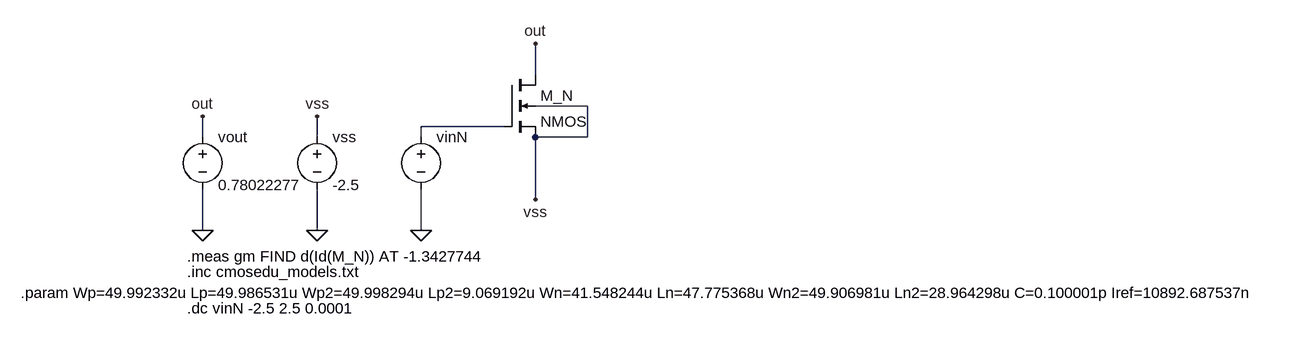
[diagram p0: schematic GM6.asc]
GM6.asc, the LTspice schematic file:
Version 4
SHEET 1 2412 680
WIRE 1008 -112 1008 -160
WIRE 1088 -64 1008 -64
WIRE 960 -32 832 -32
WIRE 496 -16 496 -48
WIRE 672 -16 672 -48
WIRE 832 -16 832 -32
WIRE 1088 -16 1088 -64
WIRE 1088 -16 1008 -16
WIRE 1008 80 1008 -16
WIRE 496 128 496 64
WIRE 672 128 672 64
WIRE 832 128 832 64
FLAG 832 128 0
FLAG 496 -48 out
FLAG 496 128 0
FLAG 1008 -160 out
FLAG 1008 80 vss
FLAG 672 -48 vss
FLAG 672 128 0
SYMBOL nmos4 960 -112 R0
SYMATTR InstName M_N
SYMATTR Value2 l={Ln2} w={Wn2}
SYMBOL voltage 832 -32 R0
WINDOW 3 24 44 Left 2
WINDOW 123 0 0 Left 2
WINDOW 39 0 0 Left 2
SYMATTR Value ""
SYMATTR InstName vinN
SYMBOL voltage 496 -32 R0
WINDOW 123 0 0 Left 2
WINDOW 39 0 0 Left 2
WINDOW 3 24 90 Left 2
SYMATTR Value 0.78022277
SYMATTR InstName vout
SYMBOL voltage 672 -32 R0
WINDOW 123 0 0 Left 2
WINDOW 39 0 0 Left 2
WINDOW 3 24 90 Left 2
SYMATTR Value -2.5
SYMATTR InstName vss
TEXT 472 192 Left 2 !.inc cmosedu_models.txt
TEXT 472 248 Left 2 !.dc vinN -2.5 2.5 0.0001
TEXT 472 168 Left 2 !.meas gm FIND d(Id(M_N)) AT -1.3427744
TEXT 216 224 Left 2 !.param Wp=49.992332u Lp=49.986531u Wp2=49.998294u Lp2=9.069192u Wn=41.548244u Ln=47.775368u Wn2=49.906981u Ln2=28.964298u C=0.100001p Iref=10892.687537n

The netlist it stands for:
* GM6.asc
M_N out N001 vss vss NMOS l={Ln2} w={Wn2}
vinN N001 0
vout out 0 0.78022277
vss vss 0 -2.5
.model NMOS NMOS
.model PMOS PMOS
.lib standard.mos
.inc cmosedu_models.txt
.dc vinN -2.5 2.5 0.0001
.meas gm FIND d(Id(M_N)) AT -1.3427744
.param Wp=49.992332u Lp=49.986531u Wp2=49.998294u Lp2=9.069192u Wn=41.548244u Ln=47.775368u Wn2=49.906981u Ln2=28.964298u C=0.100001p Iref=10892.687537n
.backanno
.end